# Altium schematic sheet Power supply.SchDoc
size A
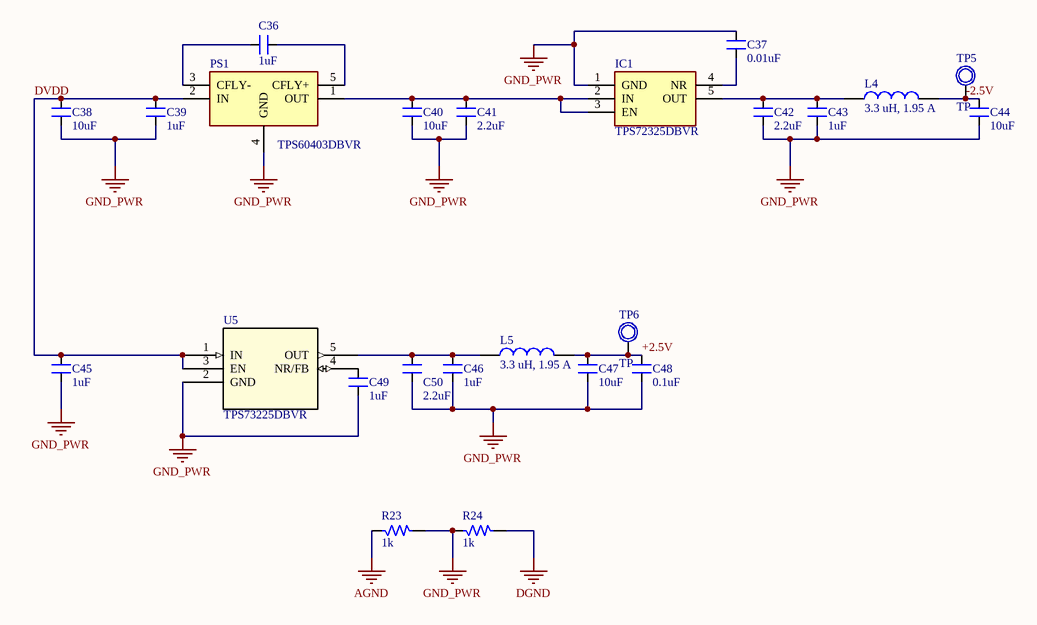
[diagram p0: Power supply.SchDoc]

## Parts
C36  1uF  [SM-0805]
C37  0.01uF  [SM-0805]
C38  10uF  [SM-0805]
C39  1uF  [SM-0805]
C40  10uF  [SM-0805]
C41  2.2uF  [SM-0805]
C42  2.2uF  [SM-0805]
C43  1uF  [SM-0805]
C44  10uF  [SM-0805]
C45  1uF  [SM-0805]
C46  1uF  [SM-0805]
C47  10uF  [SM-0805]
C48  0.1uF  [SM-0805]
C49  1uF  [SM-0805]
C50  2.2uF  [SM-0805]
IC1  TPS72325DBVR  [SOT95P280X145-5N]
L4  3.3 uH, 1.95 A  [WE-TPC_4818]
L5  3.3 uH, 1.95 A  [WE-TPC_4818]
PS1  TPS60403DBVR  [SOT95P280X145-5N]
R23  1k  [SM-0805]
R24  1k  [SM-0805]
TP5  TP  [TP1]
TP6  TP  [TP1]
U5  TPS73225DBVR  [DBV5]

## Nets
AGND: R23.1
DGND: R24.2
GND_PWR: C37.2 C38.1 C39.1 C40.1 C41.1 C42.1 C43.1 C44.1 C45.1 C46.1 C47.1 C48.1 C49.1 C50.1 IC1.1(GND) PS1.4(GND) R23.2 R24.1 U5.2(GND)
+2.5V: C47.2 C48.2 L5.2 TP6.1
-2.5V: C44.2 L4.2 TP5.1
DVDD: C38.2 C39.2 C45.2 PS1.2(IN) U5.1(IN) U5.3(EN)
NetC36_1: C36.1 PS1.5(CFLY+)
NetC36_2: C36.2 PS1.3(CFLY-)
NetC37_1: C37.1 IC1.4(NR)
NetC40_2: C40.2 C41.2 IC1.2(IN) IC1.3(EN) PS1.1(OUT)
NetC42_2: C42.2 C43.2 IC1.5(OUT) L4.1
NetC46_2: C46.2 C50.2 L5.1 U5.5(OUT)
NetC49_2: C49.2 U5.4(NR/FB)

## Library data of the parts
C36-C50 = CM: Cap SMD; Value: 103
IC1 = TPS72325DBVR: Integrated Circuit; Manufacturer_Name: Texas Instruments; Datasheet Link: http://www.mouser.com/ds/2/405/tps723-558413.pdf; Height: 1.45mm; Mouser Part Number: 595-TPS72325DBVR; Mouser Price/Stock: https://www.mouser.com/Search/Refine.aspx?Keyword=595-TPS72325DBVR; Manufacturer_Part_Number: TPS72325DBVR
L4 L5 = 744042003: SMT Shielded Tiny Power Inductor WE-TPC, size 4818, 3.3 uH, 1.95 A; Rated Current: 1.95 A; Inductance: 3.3 uH; DC Resistance max.: 65 mOhm; Self Resonant Frequency: 80 MHz; Saturation Current: 1.8 A; ComponentLink1Description: Manufacturer; ComponentLink1URL: http://www.we-online.de; ComponentLink2Description: Datasheet; ComponentLink2URL: https://katalog.we-online.com/pbs/datasheet/744042003.pdf; Part Number: 744042003; Published Date: December 2018; Publisher: Wurth Elektronik; Size: 4818; Operating Temperature: -40 to +125 degC; Mounting Technology: SMT; Packaging: Tape and Reel
PS1 = TPS60403DBVR: Power Supply; Manufacturer_Name: Texas Instruments; Datasheet Link: http://www.ti.com/lit/gpn/tps60403; Height: 1.45mm; Mouser Part Number: 595-TPS60403DBVR; Mouser Price/Stock: https://www.mouser.com/Search/Refine.aspx?Keyword=595-TPS60403DBVR; Manufacturer_Part_Number: TPS60403DBVR
R23 R24 = R: Resistor 1/4W; Value: R1/4W - 1K
TP5 TP6 = TP1: Test Point; Value: Test Point
U5 = TPS73225DBVR: No Description Available; Vendor: Texas Instruments; Built_By: EMA_UL_Team; Manufacturer_Part_Number: TPS73225DBVR; Manufacturer: Texas Instruments; Copyright: Copyright (C) 2018 Accelerated Designs. All rights reserved; RefDes: RefDes; Type: DEV; Value: Value